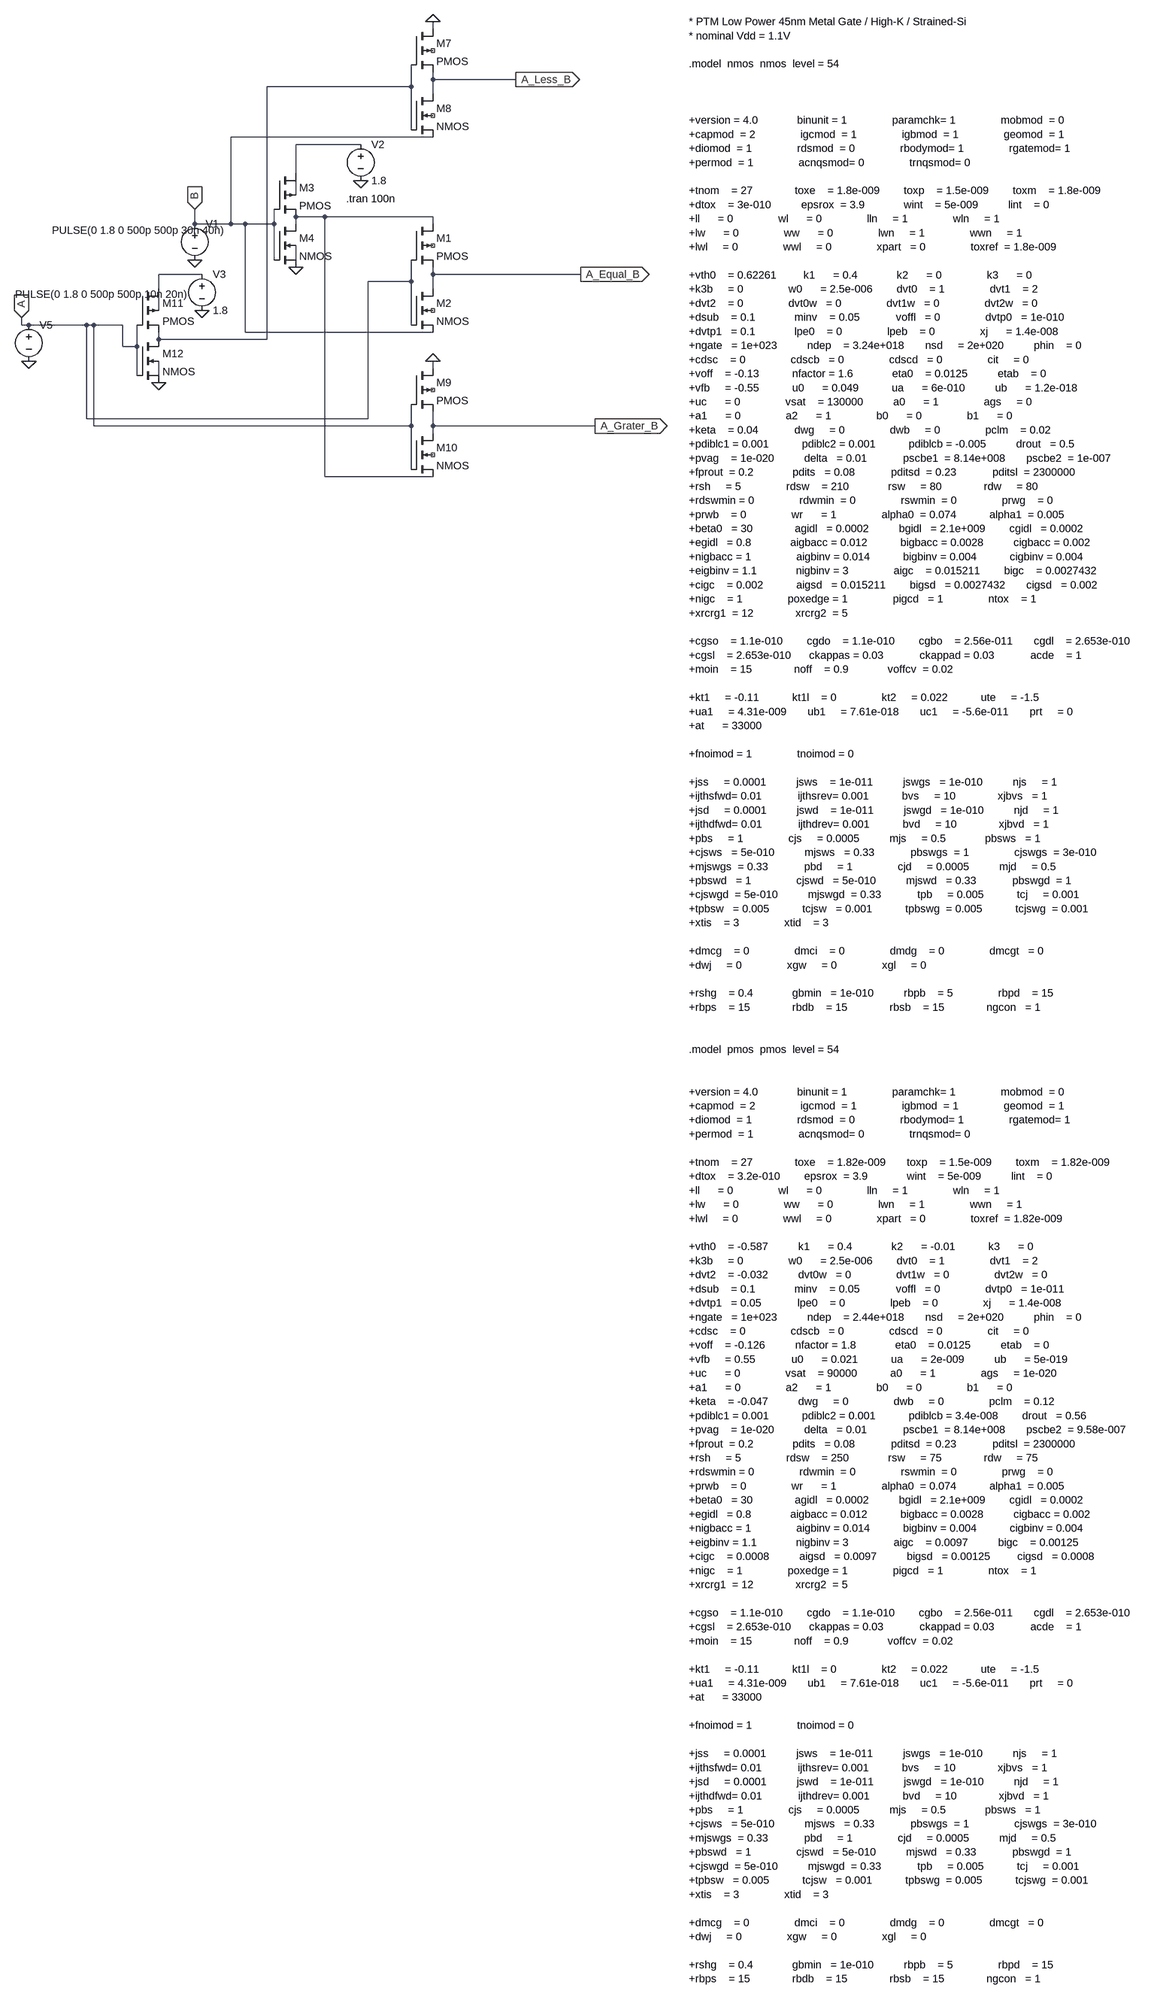
[diagram p0: schematic Comparator-gdi-45nm.asc]
Comparator-gdi-45nm.asc, the LTspice schematic file:
Version 4
SHEET 1 1740 2792
WIRE 304 -272 304 -288
WIRE 304 -160 304 -176
WIRE 496 -160 304 -160
WIRE 256 -144 256 -192
WIRE 256 -144 -64 -144
WIRE 304 -128 304 -160
WIRE 256 -48 256 -144
WIRE 304 -32 -144 -32
WIRE 144 -16 0 -16
WIRE 0 48 0 -16
WIRE 0 96 0 64
WIRE 64 144 0 144
WIRE 304 144 64 144
WIRE -224 160 -224 128
WIRE -144 160 -144 -32
WIRE -144 160 -224 160
WIRE -112 160 -144 160
WIRE -48 160 -48 128
WIRE -48 160 -112 160
WIRE 0 160 0 144
WIRE 304 160 304 144
WIRE -48 240 -48 160
WIRE 0 240 0 208
WIRE -208 272 -304 272
WIRE 304 272 304 256
WIRE 640 272 304 272
WIRE 256 288 256 240
WIRE 256 288 160 288
WIRE -304 304 -304 272
WIRE 304 304 304 272
WIRE -304 352 -304 320
WIRE -608 384 -608 368
WIRE -592 384 -608 384
WIRE -464 384 -592 384
WIRE -448 384 -464 384
WIRE -384 384 -448 384
WIRE 256 384 256 288
WIRE -112 400 -112 160
WIRE 304 400 -112 400
WIRE -304 416 -304 400
WIRE -64 416 -64 -144
WIRE -64 416 -304 416
WIRE -384 432 -384 384
WIRE -352 432 -352 384
WIRE -352 432 -384 432
WIRE 304 480 304 464
WIRE -352 496 -352 432
WIRE -304 496 -304 464
WIRE -464 592 -464 384
WIRE 160 592 160 288
WIRE 160 592 -464 592
WIRE -448 608 -448 384
WIRE 256 608 256 560
WIRE 256 608 -448 608
WIRE 304 608 304 576
WIRE 672 608 304 608
WIRE 304 624 304 608
WIRE 256 704 256 608
WIRE 64 720 64 144
WIRE 304 720 64 720
FLAG -224 240 0
FLAG -224 128 B
IOPIN -224 128 In
FLAG 144 64 0
FLAG 0 256 0
FLAG 640 272 A_Equal_B
IOPIN 640 272 Out
FLAG 304 -288 0
FLAG 304 464 0
FLAG -304 512 0
FLAG -592 464 0
FLAG -608 368 A
IOPIN -608 368 In
FLAG -208 352 0
FLAG 496 -160 A_Less_B
IOPIN 496 -160 Out
FLAG 672 608 A_Grater_B
IOPIN 672 608 Out
SYMBOL pmos4 256 160 R0
SYMATTR InstName M1
SYMATTR Value2 l=45nm w=135nm
SYMBOL nmos4 256 304 R0
SYMATTR InstName M2
SYMATTR Value2 l=45nm w=135nm
SYMBOL pmos4 -48 48 R0
SYMATTR InstName M3
SYMATTR Value2 l=45nm w=135nm
SYMBOL nmos4 -48 160 R0
SYMATTR InstName M4
SYMATTR Value2 l=45nm w=135nm
SYMBOL voltage -224 144 R0
WINDOW 3 -317 30 Left 2
WINDOW 123 0 0 Left 0
WINDOW 39 0 0 Left 0
SYMATTR Value PULSE(0 1.8 0 500p 500p 30n 40n)
SYMATTR InstName V1
SYMBOL voltage 144 -32 R0
WINDOW 123 0 0 Left 0
WINDOW 39 0 0 Left 0
SYMATTR InstName V2
SYMATTR Value 1.8
SYMBOL pmos4 256 -272 R0
SYMATTR InstName M7
SYMATTR Value2 l=45nm w=135nm
SYMBOL nmos4 256 -128 R0
SYMATTR InstName M8
SYMATTR Value2 l=45nm w=135nm
SYMBOL pmos4 256 480 R0
SYMATTR InstName M9
SYMATTR Value2 l=45nm w=135nm
SYMBOL nmos4 256 624 R0
SYMATTR InstName M10
SYMATTR Value2 l=45nm w=135nm
SYMBOL pmos4 -352 304 R0
SYMATTR InstName M11
SYMATTR Value2 l=45nm w=135nm
SYMBOL nmos4 -352 416 R0
SYMATTR InstName M12
SYMATTR Value2 l=45nm w=135nm
SYMBOL voltage -592 368 R0
WINDOW 3 -30 -52 Left 2
WINDOW 123 0 0 Left 0
WINDOW 39 0 0 Left 0
SYMATTR Value PULSE(0 1.8 0 500p 500p 10n 20n)
SYMATTR InstName V5
SYMBOL voltage -208 256 R0
WINDOW 123 0 0 Left 0
WINDOW 39 0 0 Left 0
SYMATTR InstName V3
SYMATTR Value 1.8
TEXT 112 104 Left 2 !.tran 100n
TEXT 880 -288 Left 2 !* PTM Low Power 45nm Metal Gate / High-K / Strained-Si\n* nominal Vdd = 1.1V\n \n.model  nmos  nmos  level = 54\n \n\n \n+version = 4.0             binunit = 1               paramchk= 1               mobmod  = 0             \n+capmod  = 2               igcmod  = 1               igbmod  = 1               geomod  = 1             \n+diomod  = 1               rdsmod  = 0               rbodymod= 1               rgatemod= 1             \n+permod  = 1               acnqsmod= 0               trnqsmod= 0             \n \n+tnom    = 27              toxe    = 1.8e-009        toxp    = 1.5e-009        toxm    = 1.8e-009      \n+dtox    = 3e-010          epsrox  = 3.9             wint    = 5e-009          lint    = 0             \n+ll      = 0               wl      = 0               lln     = 1               wln     = 1             \n+lw      = 0               ww      = 0               lwn     = 1               wwn     = 1             \n+lwl     = 0               wwl     = 0               xpart   = 0               toxref  = 1.8e-009      \n \n+vth0    = 0.62261         k1      = 0.4             k2      = 0               k3      = 0             \n+k3b     = 0               w0      = 2.5e-006        dvt0    = 1               dvt1    = 2             \n+dvt2    = 0               dvt0w   = 0               dvt1w   = 0               dvt2w   = 0             \n+dsub    = 0.1             minv    = 0.05            voffl   = 0               dvtp0   = 1e-010        \n+dvtp1   = 0.1             lpe0    = 0               lpeb    = 0               xj      = 1.4e-008      \n+ngate   = 1e+023          ndep    = 3.24e+018       nsd     = 2e+020          phin    = 0             \n+cdsc    = 0               cdscb   = 0               cdscd   = 0               cit     = 0             \n+voff    = -0.13           nfactor = 1.6             eta0    = 0.0125          etab    = 0             \n+vfb     = -0.55           u0      = 0.049           ua      = 6e-010          ub      = 1.2e-018      \n+uc      = 0               vsat    = 130000          a0      = 1               ags     = 0             \n+a1      = 0               a2      = 1               b0      = 0               b1      = 0             \n+keta    = 0.04            dwg     = 0               dwb     = 0               pclm    = 0.02          \n+pdiblc1 = 0.001           pdiblc2 = 0.001           pdiblcb = -0.005          drout   = 0.5           \n+pvag    = 1e-020          delta   = 0.01            pscbe1  = 8.14e+008       pscbe2  = 1e-007        \n+fprout  = 0.2             pdits   = 0.08            pditsd  = 0.23            pditsl  = 2300000       \n+rsh     = 5               rdsw    = 210             rsw     = 80              rdw     = 80            \n+rdswmin = 0               rdwmin  = 0               rswmin  = 0               prwg    = 0             \n+prwb    = 0               wr      = 1               alpha0  = 0.074           alpha1  = 0.005         \n+beta0   = 30              agidl   = 0.0002          bgidl   = 2.1e+009        cgidl   = 0.0002        \n+egidl   = 0.8             aigbacc = 0.012           bigbacc = 0.0028          cigbacc = 0.002         \n+nigbacc = 1               aigbinv = 0.014           bigbinv = 0.004           cigbinv = 0.004         \n+eigbinv = 1.1             nigbinv = 3               aigc    = 0.015211        bigc    = 0.0027432     \n+cigc    = 0.002           aigsd   = 0.015211        bigsd   = 0.0027432       cigsd   = 0.002         \n+nigc    = 1               poxedge = 1               pigcd   = 1               ntox    = 1             \n+xrcrg1  = 12              xrcrg2  = 5             \n \n+cgso    = 1.1e-010        cgdo    = 1.1e-010        cgbo    = 2.56e-011       cgdl    = 2.653e-010    \n+cgsl    = 2.653e-010      ckappas = 0.03            ckappad = 0.03            acde    = 1             \n+moin    = 15              noff    = 0.9             voffcv  = 0.02          \n \n+kt1     = -0.11           kt1l    = 0               kt2     = 0.022           ute     = -1.5          \n+ua1     = 4.31e-009       ub1     = 7.61e-018       uc1     = -5.6e-011       prt     = 0             \n+at      = 33000         \n \n+fnoimod = 1               tnoimod = 0             \n \n+jss     = 0.0001          jsws    = 1e-011          jswgs   = 1e-010          njs     = 1             \n+ijthsfwd= 0.01            ijthsrev= 0.001           bvs     = 10              xjbvs   = 1             \n+jsd     = 0.0001          jswd    = 1e-011          jswgd   = 1e-010          njd     = 1             \n+ijthdfwd= 0.01            ijthdrev= 0.001           bvd     = 10              xjbvd   = 1             \n+pbs     = 1               cjs     = 0.0005          mjs     = 0.5             pbsws   = 1             \n+cjsws   = 5e-010          mjsws   = 0.33            pbswgs  = 1               cjswgs  = 3e-010        \n+mjswgs  = 0.33            pbd     = 1               cjd     = 0.0005          mjd     = 0.5           \n+pbswd   = 1               cjswd   = 5e-010          mjswd   = 0.33            pbswgd  = 1             \n+cjswgd  = 5e-010          mjswgd  = 0.33            tpb     = 0.005           tcj     = 0.001         \n+tpbsw   = 0.005           tcjsw   = 0.001           tpbswg  = 0.005           tcjswg  = 0.001         \n+xtis    = 3               xtid    = 3             \n \n+dmcg    = 0               dmci    = 0               dmdg    = 0               dmcgt   = 0             \n+dwj     = 0               xgw     = 0               xgl     = 0             \n \n+rshg    = 0.4             gbmin   = 1e-010          rbpb    = 5               rbpd    = 15            \n+rbps    = 15              rbdb    = 15              rbsb    = 15              ngcon   = 1             \n \n\n.model  pmos  pmos  level = 54\n \n\n+version = 4.0             binunit = 1               paramchk= 1               mobmod  = 0             \n+capmod  = 2               igcmod  = 1               igbmod  = 1               geomod  = 1             \n+diomod  = 1               rdsmod  = 0               rbodymod= 1               rgatemod= 1             \n+permod  = 1               acnqsmod= 0               trnqsmod= 0             \n \n+tnom    = 27              toxe    = 1.82e-009       toxp    = 1.5e-009        toxm    = 1.82e-009     \n+dtox    = 3.2e-010        epsrox  = 3.9             wint    = 5e-009          lint    = 0             \n+ll      = 0               wl      = 0               lln     = 1               wln     = 1             \n+lw      = 0               ww      = 0               lwn     = 1               wwn     = 1             \n+lwl     = 0               wwl     = 0               xpart   = 0               toxref  = 1.82e-009     \n \n+vth0    = -0.587          k1      = 0.4             k2      = -0.01           k3      = 0             \n+k3b     = 0               w0      = 2.5e-006        dvt0    = 1               dvt1    = 2             \n+dvt2    = -0.032          dvt0w   = 0               dvt1w   = 0               dvt2w   = 0             \n+dsub    = 0.1             minv    = 0.05            voffl   = 0               dvtp0   = 1e-011        \n+dvtp1   = 0.05            lpe0    = 0               lpeb    = 0               xj      = 1.4e-008      \n+ngate   = 1e+023          ndep    = 2.44e+018       nsd     = 2e+020          phin    = 0             \n+cdsc    = 0               cdscb   = 0               cdscd   = 0               cit     = 0             \n+voff    = -0.126          nfactor = 1.8             eta0    = 0.0125          etab    = 0             \n+vfb     = 0.55            u0      = 0.021           ua      = 2e-009          ub      = 5e-019        \n+uc      = 0               vsat    = 90000           a0      = 1               ags     = 1e-020        \n+a1      = 0               a2      = 1               b0      = 0               b1      = 0             \n+keta    = -0.047          dwg     = 0               dwb     = 0               pclm    = 0.12          \n+pdiblc1 = 0.001           pdiblc2 = 0.001           pdiblcb = 3.4e-008        drout   = 0.56          \n+pvag    = 1e-020          delta   = 0.01            pscbe1  = 8.14e+008       pscbe2  = 9.58e-007     \n+fprout  = 0.2             pdits   = 0.08            pditsd  = 0.23            pditsl  = 2300000       \n+rsh     = 5               rdsw    = 250             rsw     = 75              rdw     = 75            \n+rdswmin = 0               rdwmin  = 0               rswmin  = 0               prwg    = 0             \n+prwb    = 0               wr      = 1               alpha0  = 0.074           alpha1  = 0.005         \n+beta0   = 30              agidl   = 0.0002          bgidl   = 2.1e+009        cgidl   = 0.0002        \n+egidl   = 0.8             aigbacc = 0.012           bigbacc = 0.0028          cigbacc = 0.002         \n+nigbacc = 1               aigbinv = 0.014           bigbinv = 0.004           cigbinv = 0.004         \n+eigbinv = 1.1             nigbinv = 3               aigc    = 0.0097          bigc    = 0.00125       \n+cigc    = 0.0008          aigsd   = 0.0097          bigsd   = 0.00125         cigsd   = 0.0008        \n+nigc    = 1               poxedge = 1               pigcd   = 1               ntox    = 1             \n+xrcrg1  = 12              xrcrg2  = 5             \n \n+cgso    = 1.1e-010        cgdo    = 1.1e-010        cgbo    = 2.56e-011       cgdl    = 2.653e-010    \n+cgsl    = 2.653e-010      ckappas = 0.03            ckappad = 0.03            acde    = 1             \n+moin    = 15              noff    = 0.9             voffcv  = 0.02          \n \n+kt1     = -0.11           kt1l    = 0               kt2     = 0.022           ute     = -1.5          \n+ua1     = 4.31e-009       ub1     = 7.61e-018       uc1     = -5.6e-011       prt     = 0             \n+at      = 33000         \n \n+fnoimod = 1               tnoimod = 0             \n \n+jss     = 0.0001          jsws    = 1e-011          jswgs   = 1e-010          njs     = 1             \n+ijthsfwd= 0.01            ijthsrev= 0.001           bvs     = 10              xjbvs   = 1             \n+jsd     = 0.0001          jswd    = 1e-011          jswgd   = 1e-010          njd     = 1             \n+ijthdfwd= 0.01            ijthdrev= 0.001           bvd     = 10              xjbvd   = 1             \n+pbs     = 1               cjs     = 0.0005          mjs     = 0.5             pbsws   = 1             \n+cjsws   = 5e-010          mjsws   = 0.33            pbswgs  = 1               cjswgs  = 3e-010        \n+mjswgs  = 0.33            pbd     = 1               cjd     = 0.0005          mjd     = 0.5           \n+pbswd   = 1               cjswd   = 5e-010          mjswd   = 0.33            pbswgd  = 1             \n+cjswgd  = 5e-010          mjswgd  = 0.33            tpb     = 0.005           tcj     = 0.001         \n+tpbsw   = 0.005           tcjsw   = 0.001           tpbswg  = 0.005           tcjswg  = 0.001         \n+xtis    = 3               xtid    = 3             \n \n+dmcg    = 0               dmci    = 0               dmdg    = 0               dmcgt   = 0             \n+dwj     = 0               xgw     = 0               xgl     = 0             \n \n+rshg    = 0.4             gbmin   = 1e-010          rbpb    = 5               rbpd    = 15            \n+rbps    = 15              rbdb    = 15              rbsb    = 15              ngcon   = 1

The netlist it stands for:
* Comparator-gdi-45nm.asc
M1 N004 A A_Equal_B NC_01 PMOS l=45nm w=135nm
M2 A_Equal_B A B NC_02 NMOS l=45nm w=135nm
M3 N002 B N004 N003 PMOS l=45nm w=135nm
M4 N004 B 0 N005 NMOS l=45nm w=135nm
V1 B 0 PULSE(0 1.8 0 500p 500p 30n 40n)
V2 N002 0 1.8
M7 0 N001 A_Less_B NC_03 PMOS l=45nm w=135nm
M8 A_Less_B N001 B NC_04 NMOS l=45nm w=135nm
M9 0 A A_Grater_B NC_05 PMOS l=45nm w=135nm
M10 A_Grater_B A N004 NC_06 NMOS l=45nm w=135nm
M11 N006 A N001 N007 PMOS l=45nm w=135nm
M12 N001 A 0 N008 NMOS l=45nm w=135nm
V5 A 0 PULSE(0 1.8 0 500p 500p 10n 20n)
V3 N006 0 1.8
.model NMOS NMOS
.model PMOS PMOS
.lib standard.mos
.tran 100n
* PTM Low Power 45nm Metal Gate / High-K / Strained-Si
* nominal Vdd = 1.1V
.model  nmos  nmos  level = 54
+version = 4.0             binunit = 1               paramchk= 1               mobmod  = 0
+capmod  = 2               igcmod  = 1               igbmod  = 1               geomod  = 1
+diomod  = 1               rdsmod  = 0               rbodymod= 1               rgatemod= 1
+permod  = 1               acnqsmod= 0               trnqsmod= 0
+tnom    = 27              toxe    = 1.8e-009        toxp    = 1.5e-009        toxm    = 1.8e-009
+dtox    = 3e-010          epsrox  = 3.9             wint    = 5e-009          lint    = 0
+ll      = 0               wl      = 0               lln     = 1               wln     = 1
+lw      = 0               ww      = 0               lwn     = 1               wwn     = 1
+lwl     = 0               wwl     = 0               xpart   = 0               toxref  = 1.8e-009
+vth0    = 0.62261         k1      = 0.4             k2      = 0               k3      = 0
+k3b     = 0               w0      = 2.5e-006        dvt0    = 1               dvt1    = 2
+dvt2    = 0               dvt0w   = 0               dvt1w   = 0               dvt2w   = 0
+dsub    = 0.1             minv    = 0.05            voffl   = 0               dvtp0   = 1e-010
+dvtp1   = 0.1             lpe0    = 0               lpeb    = 0               xj      = 1.4e-008
+ngate   = 1e+023          ndep    = 3.24e+018       nsd     = 2e+020          phin    = 0
+cdsc    = 0               cdscb   = 0               cdscd   = 0               cit     = 0
+voff    = -0.13           nfactor = 1.6             eta0    = 0.0125          etab    = 0
+vfb     = -0.55           u0      = 0.049           ua      = 6e-010          ub      = 1.2e-018
+uc      = 0               vsat    = 130000          a0      = 1               ags     = 0
+a1      = 0               a2      = 1               b0      = 0               b1      = 0
+keta    = 0.04            dwg     = 0               dwb     = 0               pclm    = 0.02
+pdiblc1 = 0.001           pdiblc2 = 0.001           pdiblcb = -0.005          drout   = 0.5
+pvag    = 1e-020          delta   = 0.01            pscbe1  = 8.14e+008       pscbe2  = 1e-007
+fprout  = 0.2             pdits   = 0.08            pditsd  = 0.23            pditsl  = 2300000
+rsh     = 5               rdsw    = 210             rsw     = 80              rdw     = 80
+rdswmin = 0               rdwmin  = 0               rswmin  = 0               prwg    = 0
+prwb    = 0               wr      = 1               alpha0  = 0.074           alpha1  = 0.005
+beta0   = 30              agidl   = 0.0002          bgidl   = 2.1e+009        cgidl   = 0.0002
+egidl   = 0.8             aigbacc = 0.012           bigbacc = 0.0028          cigbacc = 0.002
+nigbacc = 1               aigbinv = 0.014           bigbinv = 0.004           cigbinv = 0.004
+eigbinv = 1.1             nigbinv = 3               aigc    = 0.015211        bigc    = 0.0027432
+cigc    = 0.002           aigsd   = 0.015211        bigsd   = 0.0027432       cigsd   = 0.002
+nigc    = 1               poxedge = 1               pigcd   = 1               ntox    = 1
+xrcrg1  = 12              xrcrg2  = 5
+cgso    = 1.1e-010        cgdo    = 1.1e-010        cgbo    = 2.56e-011       cgdl    = 2.653e-010
+cgsl    = 2.653e-010      ckappas = 0.03            ckappad = 0.03            acde    = 1
+moin    = 15              noff    = 0.9             voffcv  = 0.02
+kt1     = -0.11           kt1l    = 0               kt2     = 0.022           ute     = -1.5
+ua1     = 4.31e-009       ub1     = 7.61e-018       uc1     = -5.6e-011       prt     = 0
+at      = 33000
+fnoimod = 1               tnoimod = 0
+jss     = 0.0001          jsws    = 1e-011          jswgs   = 1e-010          njs     = 1
+ijthsfwd= 0.01            ijthsrev= 0.001           bvs     = 10              xjbvs   = 1
+jsd     = 0.0001          jswd    = 1e-011          jswgd   = 1e-010          njd     = 1
+ijthdfwd= 0.01            ijthdrev= 0.001           bvd     = 10              xjbvd   = 1
+pbs     = 1               cjs     = 0.0005          mjs     = 0.5             pbsws   = 1
+cjsws   = 5e-010          mjsws   = 0.33            pbswgs  = 1               cjswgs  = 3e-010
+mjswgs  = 0.33            pbd     = 1               cjd     = 0.0005          mjd     = 0.5
+pbswd   = 1               cjswd   = 5e-010          mjswd   = 0.33            pbswgd  = 1
+cjswgd  = 5e-010          mjswgd  = 0.33            tpb     = 0.005           tcj     = 0.001
+tpbsw   = 0.005           tcjsw   = 0.001           tpbswg  = 0.005           tcjswg  = 0.001
+xtis    = 3               xtid    = 3
+dmcg    = 0               dmci    = 0               dmdg    = 0               dmcgt   = 0
+dwj     = 0               xgw     = 0               xgl     = 0
+rshg    = 0.4             gbmin   = 1e-010          rbpb    = 5               rbpd    = 15
+rbps    = 15              rbdb    = 15              rbsb    = 15              ngcon   = 1
.model  pmos  pmos  level = 54
+version = 4.0             binunit = 1               paramchk= 1               mobmod  = 0
+capmod  = 2               igcmod  = 1               igbmod  = 1               geomod  = 1
+diomod  = 1               rdsmod  = 0               rbodymod= 1               rgatemod= 1
+permod  = 1               acnqsmod= 0               trnqsmod= 0
+tnom    = 27              toxe    = 1.82e-009       toxp    = 1.5e-009        toxm    = 1.82e-009
+dtox    = 3.2e-010        epsrox  = 3.9             wint    = 5e-009          lint    = 0
+ll      = 0               wl      = 0               lln     = 1               wln     = 1
+lw      = 0               ww      = 0               lwn     = 1               wwn     = 1
+lwl     = 0               wwl     = 0               xpart   = 0               toxref  = 1.82e-009
+vth0    = -0.587          k1      = 0.4             k2      = -0.01           k3      = 0
+k3b     = 0               w0      = 2.5e-006        dvt0    = 1               dvt1    = 2
+dvt2    = -0.032          dvt0w   = 0               dvt1w   = 0               dvt2w   = 0
+dsub    = 0.1             minv    = 0.05            voffl   = 0               dvtp0   = 1e-011
+dvtp1   = 0.05            lpe0    = 0               lpeb    = 0               xj      = 1.4e-008
+ngate   = 1e+023          ndep    = 2.44e+018       nsd     = 2e+020          phin    = 0
+cdsc    = 0               cdscb   = 0               cdscd   = 0               cit     = 0
+voff    = -0.126          nfactor = 1.8             eta0    = 0.0125          etab    = 0
+vfb     = 0.55            u0      = 0.021           ua      = 2e-009          ub      = 5e-019
+uc      = 0               vsat    = 90000           a0      = 1               ags     = 1e-020
+a1      = 0               a2      = 1               b0      = 0               b1      = 0
+keta    = -0.047          dwg     = 0               dwb     = 0               pclm    = 0.12
+pdiblc1 = 0.001           pdiblc2 = 0.001           pdiblcb = 3.4e-008        drout   = 0.56
+pvag    = 1e-020          delta   = 0.01            pscbe1  = 8.14e+008       pscbe2  = 9.58e-007
+fprout  = 0.2             pdits   = 0.08            pditsd  = 0.23            pditsl  = 2300000
+rsh     = 5               rdsw    = 250             rsw     = 75              rdw     = 75
+rdswmin = 0               rdwmin  = 0               rswmin  = 0               prwg    = 0
+prwb    = 0               wr      = 1               alpha0  = 0.074           alpha1  = 0.005
+beta0   = 30              agidl   = 0.0002          bgidl   = 2.1e+009        cgidl   = 0.0002
+egidl   = 0.8             aigbacc = 0.012           bigbacc = 0.0028          cigbacc = 0.002
+nigbacc = 1               aigbinv = 0.014           bigbinv = 0.004           cigbinv = 0.004
+eigbinv = 1.1             nigbinv = 3               aigc    = 0.0097          bigc    = 0.00125
+cigc    = 0.0008          aigsd   = 0.0097          bigsd   = 0.00125         cigsd   = 0.0008
+nigc    = 1               poxedge = 1               pigcd   = 1               ntox    = 1
+xrcrg1  = 12              xrcrg2  = 5
+cgso    = 1.1e-010        cgdo    = 1.1e-010        cgbo    = 2.56e-011       cgdl    = 2.653e-010
+cgsl    = 2.653e-010      ckappas = 0.03            ckappad = 0.03            acde    = 1
+moin    = 15              noff    = 0.9             voffcv  = 0.02
+kt1     = -0.11           kt1l    = 0               kt2     = 0.022           ute     = -1.5
+ua1     = 4.31e-009       ub1     = 7.61e-018       uc1     = -5.6e-011       prt     = 0
+at      = 33000
+fnoimod = 1               tnoimod = 0
+jss     = 0.0001          jsws    = 1e-011          jswgs   = 1e-010          njs     = 1
+ijthsfwd= 0.01            ijthsrev= 0.001           bvs     = 10              xjbvs   = 1
+jsd     = 0.0001          jswd    = 1e-011          jswgd   = 1e-010          njd     = 1
+ijthdfwd= 0.01            ijthdrev= 0.001           bvd     = 10              xjbvd   = 1
+pbs     = 1               cjs     = 0.0005          mjs     = 0.5             pbsws   = 1
+cjsws   = 5e-010          mjsws   = 0.33            pbswgs  = 1               cjswgs  = 3e-010
+mjswgs  = 0.33            pbd     = 1               cjd     = 0.0005          mjd     = 0.5
+pbswd   = 1               cjswd   = 5e-010          mjswd   = 0.33            pbswgd  = 1
+cjswgd  = 5e-010          mjswgd  = 0.33            tpb     = 0.005           tcj     = 0.001
+tpbsw   = 0.005           tcjsw   = 0.001           tpbswg  = 0.005           tcjswg  = 0.001
+xtis    = 3               xtid    = 3
+dmcg    = 0               dmci    = 0               dmdg    = 0               dmcgt   = 0
+dwj     = 0               xgw     = 0               xgl     = 0
+rshg    = 0.4             gbmin   = 1e-010          rbpb    = 5               rbpd    = 15
+rbps    = 15              rbdb    = 15              rbsb    = 15              ngcon   = 1
.backanno
.end